# Altium schematic sheet 009_ToSourceBoard.SchDoc
size A4; Organization: OLTEST; Revision: 01; SheetNumber: 9; SheetTotal: 12; Название листа: Название листа; Разработчик: Бондарчук С.; Прибор: R100; АМАК.000000.000 Э3: R100.220.040.000 Э3; Дата: 16.01.2018; Формат: A4
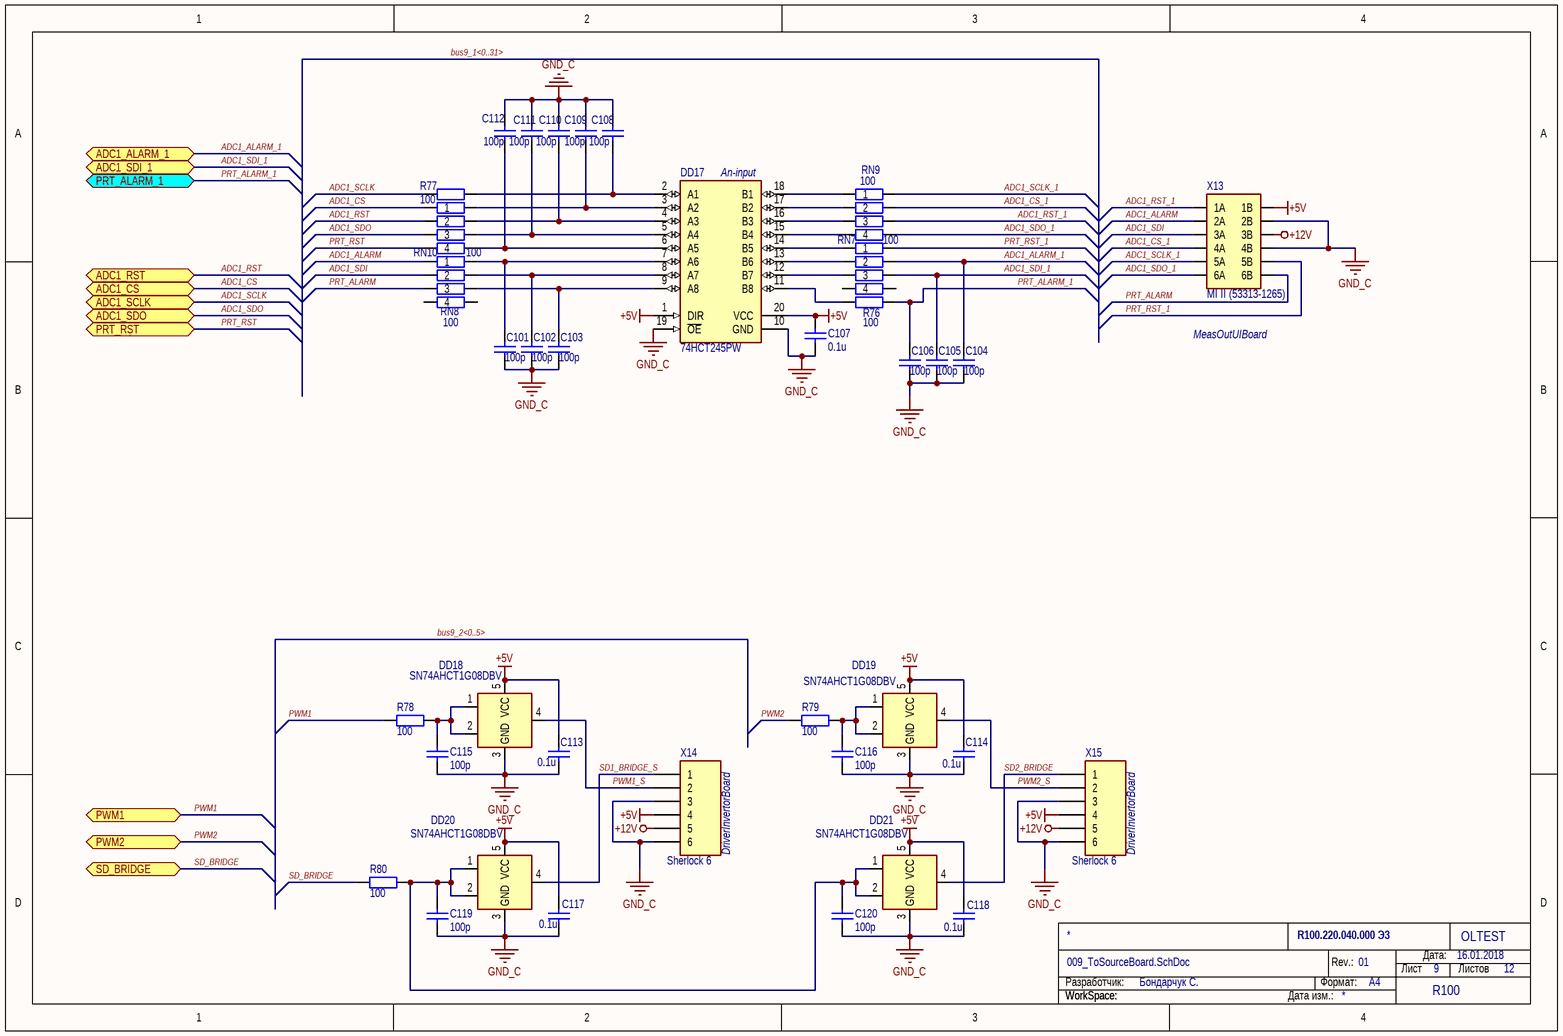
[diagram p0: 009_ToSourceBoard.SchDoc]

## Parts
C101  100p  [SMD_C_0603]
C102  100p  [SMD_C_0603]
C103  100p  [SMD_C_0603]
C104  100p  [SMD_C_0603]
C105  100p  [SMD_C_0603]
C106  100p  [SMD_C_0603]
C107  0.1u  [SMD_C_0603]
C108  100p  [SMD_C_0603]
C109  100p  [SMD_C_0603]
C110  100p  [SMD_C_0603]
C111  100p  [SMD_C_0603]
C112  100p  [SMD_C_0603]
C113  0.1u  [SMD_C_0603]
C114  0.1u  [SMD_C_0603]
C115  100p  [SMD_C_0603]
C116  100p  [SMD_C_0603]
C117  0.1u  [SMD_C_0603]
C118  0.1u  [SMD_C_0603]
C119  100p  [SMD_C_0603]
C120  100p  [SMD_C_0603]
DD17  74HCT245PW  [PW0020A_M]
DD18  SN74AHCT1G08DBV  [SOT-23(DBV)]
DD19  SN74AHCT1G08DBV  [SOT-23(DBV)]
DD20  SN74AHCT1G08DBV  [SOT-23(DBV)]
DD21  SN74AHCT1G08DBV  [SOT-23(DBV)]
R76  100  [SMD_R_0603]
R77  100  [SMD_R_0603]
R78  100  [SMD_R_0603]
R79  100  [SMD_R_0603]
R80  100  [SMD_R_0603]
RN7  100  [CRA06S]
RN8  100  [CRA06S]
RN9  100  [CRA06S]
RN10  100  [CRA06S]
X13  MI II (53313-1265)  [53313-1265]
X14  Sherlock 6  [35362-0650]
X15  Sherlock 6  [35362-0650]

## Ports
ADC1_ALARM_1, ADC1_CS, ADC1_RST, ADC1_SCLK, ADC1_SDI_1, ADC1_SDO, PRT_ALARM_1, PRT_RST, PWM1, PWM2, SD_BRIDGE

## Nets
+5V: C107.2 C113.2 C114.2 C117.2 C118.2 DD17.1(DIR) DD17.20(VCC) DD18.5(VCC) DD19.5(VCC) DD20.5(VCC) DD21.5(VCC) X13.1B X14.4 X15.4
+12V: X13.3B X14.5 X15.5
GND_C: C101.1 C102.1 C103.1 C104.1 C105.1 C106.1 C107.1 C108.1 C109.1 C110.1 C111.1 C112.1 C113.1 C114.1 C115.1 C116.1 C117.1 C118.1 C119.1 C120.1 DD17.10(GND) DD17.19(~{OE}) DD18.3(GND) DD19.3(GND) DD20.3(GND) DD21.3(GND) X13.2B X13.4B X14.3 X14.6 X15.3 X15.6
ADC1_ALARM: RN8.1 X13.2A
ADC1_ALARM_1: C104.2 RN7.7 ; port ADC1_ALARM_1
ADC1_CS: RN10.1 ; port ADC1_CS
ADC1_CS_1: RN9.7 X13.4A
ADC1_RST: RN10.2 ; port ADC1_RST
ADC1_RST_1: RN9.6 X13.1A
ADC1_SCLK: R77.1 ; port ADC1_SCLK
ADC1_SCLK_1: RN9.8 X13.5A
ADC1_SDI: RN8.2 X13.3A
ADC1_SDI_1: C105.2 RN7.6 ; port ADC1_SDI_1
ADC1_SDO: RN10.3 ; port ADC1_SDO
ADC1_SDO_1: RN9.5 X13.6A
PRT_ALARM: RN8.3 X13.6B
PRT_ALARM_1: C106.2 R76.2 ; port PRT_ALARM_1
PRT_RST: RN10.4 ; port PRT_RST
PRT_RST_1: RN7.8 X13.5B
PWM1: R78.1 ; port PWM1
PWM1_S: DD18.4 X14.2
PWM2: R79.1 ; port PWM2
PWM2_S: DD19.4 X15.2
SD1_BRIDGE_S: DD20.4 X14.1
SD2_BRIDGE: DD21.4 X15.1
SD_BRIDGE: R80.1 ; port SD_BRIDGE
NetC101_2: C101.2 DD17.7(A6) RN8.8
NetC102_2: C102.2 DD17.8(A7) RN8.7
NetC103_2: C103.2 DD17.9(A8) RN8.6
NetC108_2: C108.2 DD17.2(A1) R77.2
NetC109_2: C109.2 DD17.3(A2) RN10.8
NetC110_2: C110.2 DD17.4(A3) RN10.7
NetC111_2: C111.2 DD17.5(A4) RN10.6
NetC112_2: C112.2 DD17.6(A5) RN10.5
NetC115_2: C115.2 DD18.1 DD18.2 R78.2
NetC116_2: C116.2 DD19.1 DD19.2 R79.2
NetC119_2: C119.2 C120.2 DD20.1 DD20.2 DD21.1 DD21.2 R80.2
NetDD17_11: DD17.11(B8) R76.1
NetDD17_12: DD17.12(B7) RN7.3
NetDD17_13: DD17.13(B6) RN7.2
NetDD17_14: DD17.14(B5) RN7.1
NetDD17_15: DD17.15(B4) RN9.4
NetDD17_16: DD17.16(B3) RN9.3
NetDD17_17: DD17.17(B2) RN9.2
NetDD17_18: DD17.18(B1) RN9.1

Not connected (* = marked no-connect by the designer): RN7 4 5; RN8 4 5

## Buses and harness runs
bus bus9_1<0..31>
bus bus9_2<0..5>

## Notes on the sheet
- (near DD17) An-input
- MeasOutUIBoard
- (near X14) DriverInvertorBoard
- (near X15) DriverInvertorBoard
- Разработчик:
- Формат:
- Rev.:
- Лист
- Дата:
- Листов
- WorkSpace:
- Дата изм.:
- (in symbol SN74AHCT1G08DBV) &

## Library data of the parts
C101-C106 C108-C112 C115 C116 C119 C120 = C0603 100p 100V 5%: SMD C 0603 MURATA 100V 5% NP0; PartNumber: GRM1885C2A101JA01; Manufacturer: MURATA; Value: 100p
C107 C113 C114 C117 C118 = C0603 0.1u 50V 10%: SMD C 0603 MURATA 50V 10% X7R; PartNumber: GRM188R71H104K; Manufacturer: MURATA; Value: 0.1u
DD17 = 74HCT245PW: Octal Bus Transceivers With 3-State Outputs, PW0020A; Manufacturer: NXP; PartNumber: 74HCT245PW
DD18-DD21 = SN74AHCT1G08DBV: 2-in AND; Manufacturer: Texas Instruments; PartNumber: SN74AHCT1G08DBV
R76-R80 = R0603 100 1%: SMD R 0603 VISHAY 0.1W 75V 1% 100ppm; PartNumber: CRCW0603100RFK; Manufacturer: VISHAY; Value: 100
RN7-RN10 = CRA06S 4x100 1%: SMD RESISTOR ARRAY VISHAY 0.063W 50V 1% 100ppm; PartNumber: CRA06S083100RF; Manufacturer: VISHAY; Value: 100
X13 = 53313-1265: MI II 12 (6x2row), 2A 125V 2mm; Manufacturer: MOLEX; PartNumber: 53313-1265
X14 X15 = 35363-0650: Sherlock 6 Side, 2A 125V 2mm; Manufacturer: MOLEX; PartNumber: 35362-0650